# EAGLE schematic heater_controller (EAGLE 6.3)
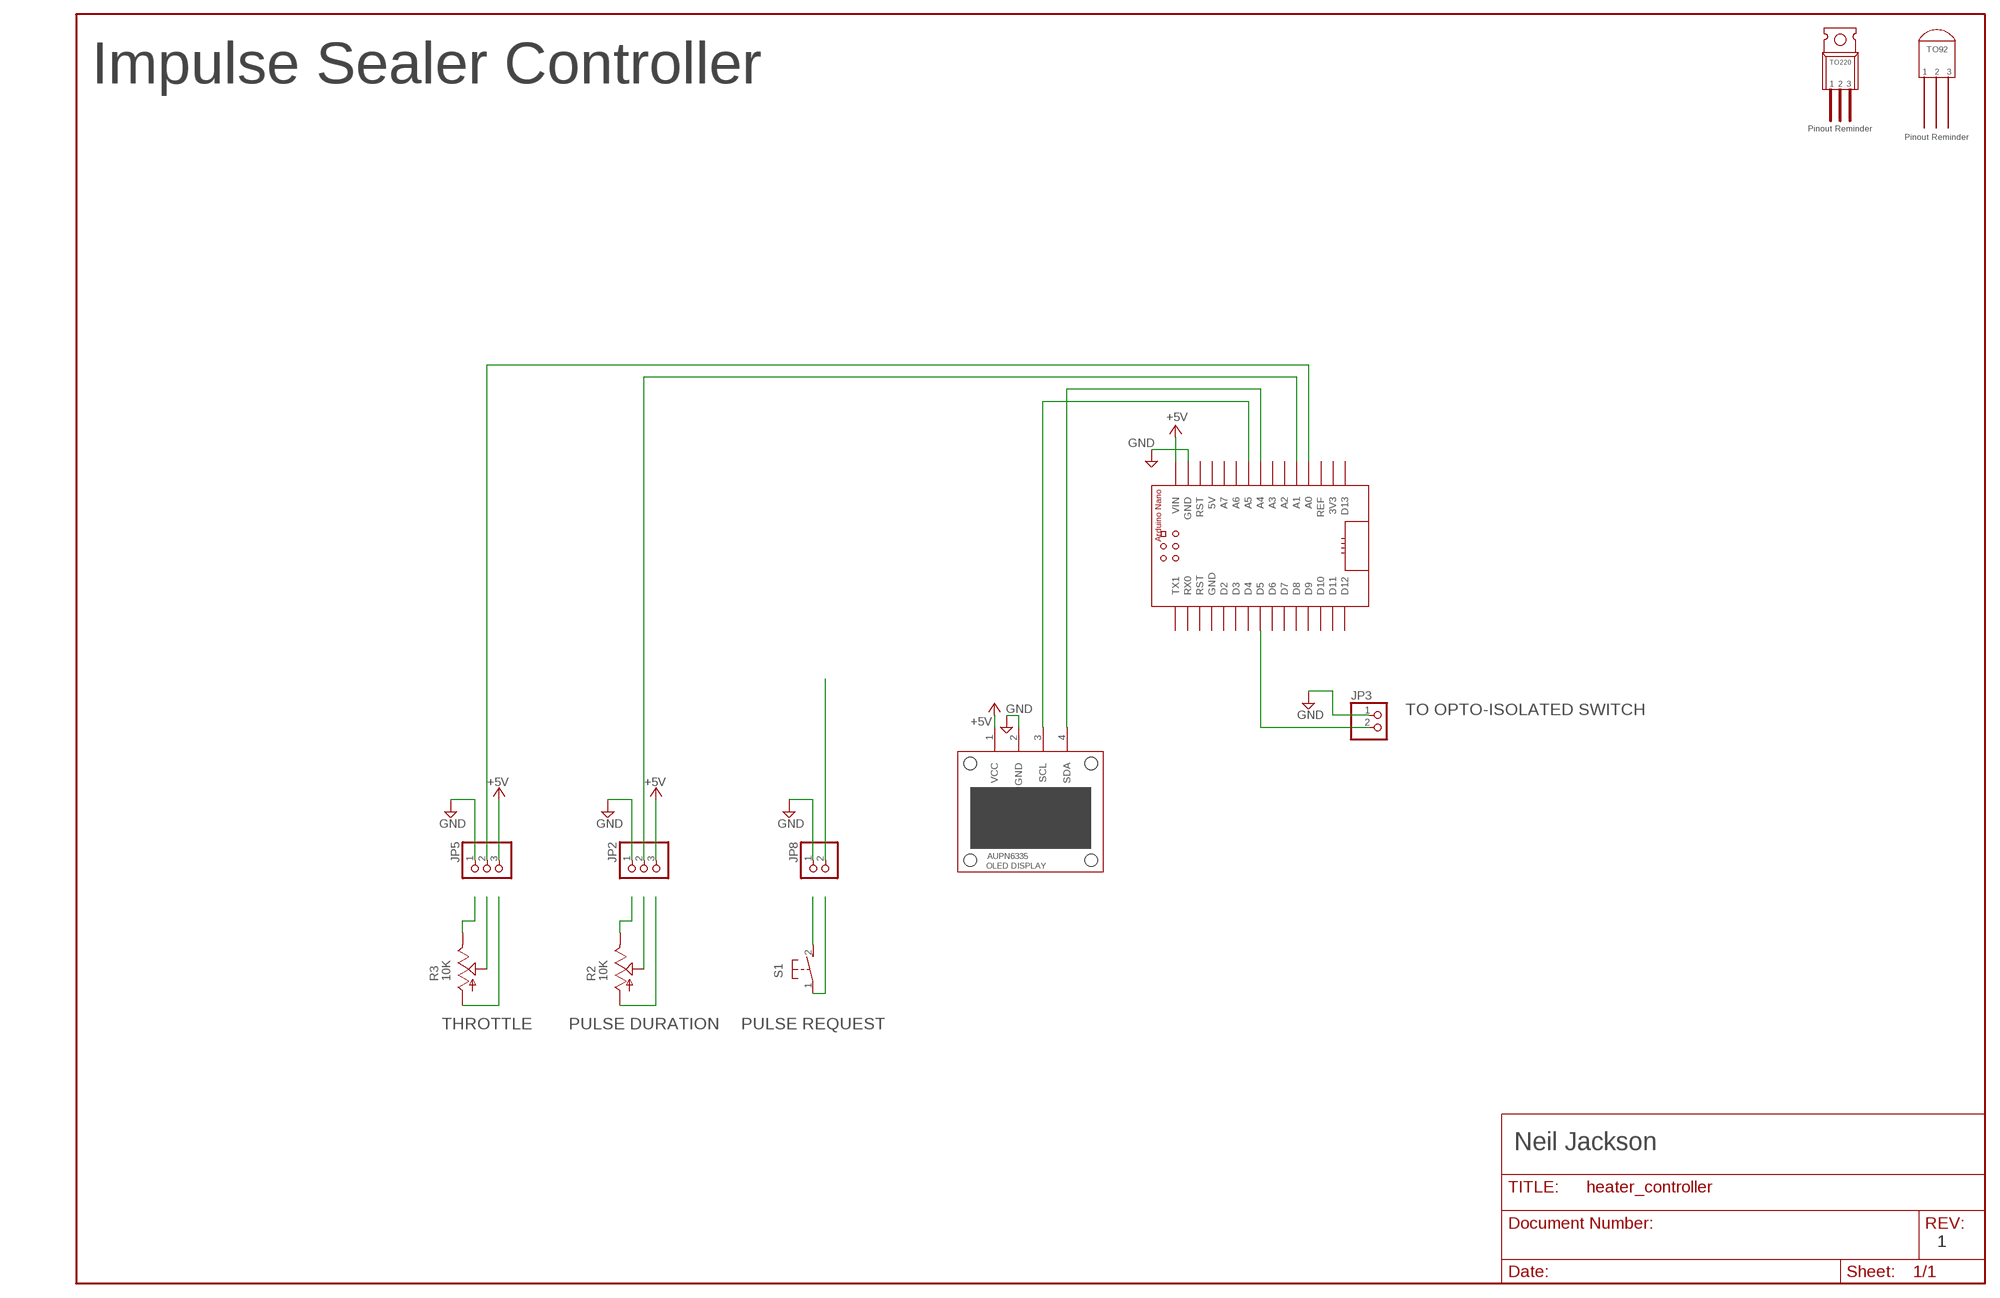
[diagram p0: schematic, sheet 1]

## Parts
JP2  PINHD-1X3  [1X03]
JP3  PINHD-1X2  [1X02]
JP5  PINHD-1X3  [1X03]
JP8  PINHD-1X2  [1X02]
R2  10K  TRIM_US-B64Y  [B64Y]
R3  10K  TRIM_US-B64Y  [B64Y]
S1  31-XX  [B3F-31XX]
U$3  AUPN6335  [AUPN6335]
U$5  ARDUINO_NANO  [ARDUINO_NANO]

## Nets
+5V: JP2.3 JP5.3 U$3.1(VCC) U$5.15(VIN)
GND: JP2.1 JP3.1 JP5.1 JP8.1 U$3.2(GND) U$5.14(GND)
N$1: JP2.2 U$5.5(A1)
N$2: S1.2(S)
N$3: S1.1(P)
N$4: R2.E
N$5: JP3.2 U$5.23(D5)
N$6: R2.S
N$7: R2.A
N$8: R3.A
N$9: U$3.3(SCL) U$5.9(A5)
N$10: R3.E
N$11: U$3.4(SDA) U$5.8(A4)
N$12: JP5.2 U$5.4(A0)
N$13: R3.S
N$14: JP8.2
Unconnected: U$5.1(D13) U$5.2(3V3) U$5.3(REF) U$5.6(A2) U$5.7(A3) U$5.10(A6) U$5.11(A7) U$5.12(5V) U$5.13(RST) U$5.16(TX1) U$5.17(RX0) U$5.18(RST) U$5.19(GND) U$5.20(D2) U$5.21(D3) U$5.22(D4) U$5.24(D6) U$5.25(D7) U$5.26(D8) U$5.27(D9) U$5.28(D10) U$5.29(D11) U$5.30(D12)

## Notes on the sheet
- Impulse Sealer Controller
- TO OPTO-ISOLATED SWITCH
- THROTTLE | PULSE DURATION | PULSE REQUEST
- Neil Jackson
- 1

## Library data of the parts
JP2 JP5 = pinhead:PINHD-1X3: PIN HEADER
JP3 JP8 = pinhead:PINHD-1X2: PIN HEADER
R2 R3 = pot:TRIM_US-: POTENTIOMETER
S1 = switch-omron:31-XX: OMRON SWITCH; MPN: B3F-3100; OC_FARNELL: 959704; OC_NEWARK: 36M3582
U$3 = aupn6335-oled-display:AUPN6335
U$5 = arduino_nano:ARDUINO_NANO